# Altium schematic sheet Drivers.SchDoc
size B
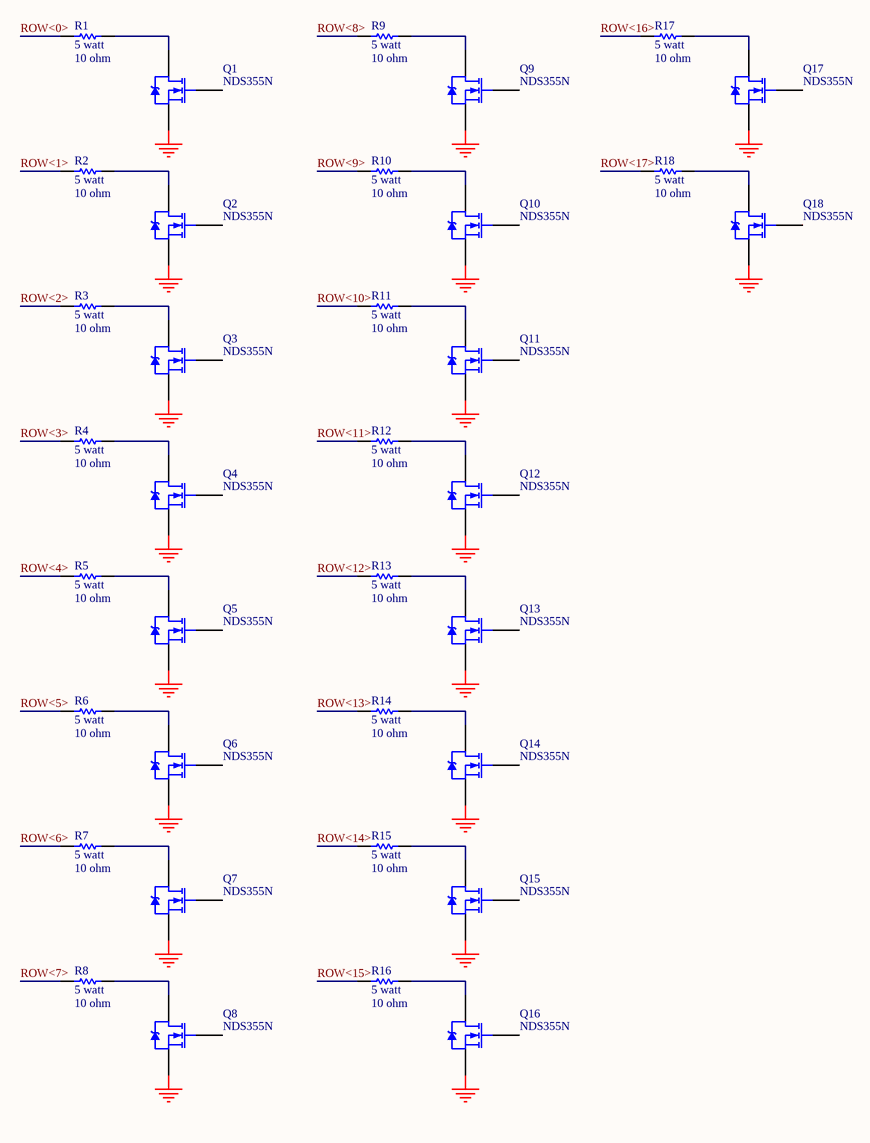
[diagram p0: Drivers.SchDoc]

## Parts
Q1  NDS355N  [SO-G3]
Q2  NDS355N  [SO-G3]
Q3  NDS355N  [SO-G3]
Q4  NDS355N  [SO-G3]
Q5  NDS355N  [SO-G3]
Q6  NDS355N  [SO-G3]
Q7  NDS355N  [SO-G3]
Q8  NDS355N  [SO-G3]
Q9  NDS355N  [SO-G3]
Q10  NDS355N  [SO-G3]
Q11  NDS355N  [SO-G3]
Q12  NDS355N  [SO-G3]
Q13  NDS355N  [SO-G3]
Q14  NDS355N  [SO-G3]
Q15  NDS355N  [SO-G3]
Q16  NDS355N  [SO-G3]
Q17  NDS355N  [SO-G3]
Q18  NDS355N  [SO-G3]
R1  5 watt  value 10 ohm  [AXIAL-1.0]
R2  5 watt  value 10 ohm  [AXIAL-1.0]
R3  5 watt  value 10 ohm  [AXIAL-1.0]
R4  5 watt  value 10 ohm  [AXIAL-1.0]
R5  5 watt  value 10 ohm  [AXIAL-1.0]
R6  5 watt  value 10 ohm  [AXIAL-1.0]
R7  5 watt  value 10 ohm  [AXIAL-1.0]
R8  5 watt  value 10 ohm  [AXIAL-1.0]
R9  5 watt  value 10 ohm  [AXIAL-1.0]
R10  5 watt  value 10 ohm  [AXIAL-1.0]
R11  5 watt  value 10 ohm  [AXIAL-1.0]
R12  5 watt  value 10 ohm  [AXIAL-1.0]
R13  5 watt  value 10 ohm  [AXIAL-1.0]
R14  5 watt  value 10 ohm  [AXIAL-1.0]
R15  5 watt  value 10 ohm  [AXIAL-1.0]
R16  5 watt  value 10 ohm  [AXIAL-1.0]
R17  5 watt  value 10 ohm  [AXIAL-1.0]
R18  5 watt  value 10 ohm  [AXIAL-1.0]

## Nets
GND: Q1.2(S) Q2.2(S) Q3.2(S) Q4.2(S) Q5.2(S) Q6.2(S) Q7.2(S) Q8.2(S) Q9.2(S) Q10.2(S) Q11.2(S) Q12.2(S) Q13.2(S) Q14.2(S) Q15.2(S) Q16.2(S) Q17.2(S) Q18.2(S)
ROW<0>: R1.1
ROW<1>: R2.1
ROW<2>: R3.1
ROW<3>: R4.1
ROW<4>: R5.1
ROW<5>: R6.1
ROW<6>: R7.1
ROW<7>: R8.1
ROW<8>: R9.1
ROW<9>: R10.1
ROW<10>: R11.1
ROW<11>: R12.1
ROW<12>: R13.1
ROW<13>: R14.1
ROW<14>: R15.1
ROW<15>: R16.1
ROW<16>: R17.1
ROW<17>: R18.1
NetQ1_3: Q1.3(D) R1.2
NetQ2_3: Q2.3(D) R2.2
NetQ3_3: Q3.3(D) R3.2
NetQ4_3: Q4.3(D) R4.2
NetQ5_3: Q5.3(D) R5.2
NetQ6_3: Q6.3(D) R6.2
NetQ7_3: Q7.3(D) R7.2
NetQ8_3: Q8.3(D) R8.2
NetQ9_3: Q9.3(D) R9.2
NetQ10_3: Q10.3(D) R10.2
NetQ11_3: Q11.3(D) R11.2
NetQ12_3: Q12.3(D) R12.2
NetQ13_3: Q13.3(D) R13.2
NetQ14_3: Q14.3(D) R14.2
NetQ15_3: Q15.3(D) R15.2
NetQ16_3: Q16.3(D) R16.2
NetQ17_3: Q17.3(D) R17.2
NetQ18_3: Q18.3(D) R18.2

Not connected (* = marked no-connect by the designer): Q1 1(G); Q2 1(G); Q3 1(G); Q4 1(G); Q5 1(G); Q6 1(G); Q7 1(G); Q8 1(G); Q9 1(G); Q10 1(G); Q11 1(G); Q12 1(G); Q13 1(G); Q14 1(G); Q15 1(G); Q16 1(G); Q17 1(G); Q18 1(G)

## Library data of the parts
Q1-Q18 = NDS355N: N-Channel Logic Level Enhancement Mode FET; Manufacturer: Fairchild; Class I: Discrete; Class II: MOSFET - Power; Package Reference: SOT23
R1-R18 = Res1: Resistor; Manufacturer: Generic Components; Class I: Passive; Class II: Resistor; Published: 8-Jun-2000; Revision: July-2002: Re-released for DXP Platform.; Publisher: Altium Limited